# Altium schematic sheet Cell Monitoring.SchDoc
size A; SheetNumber: 8; SheetTotal: 8
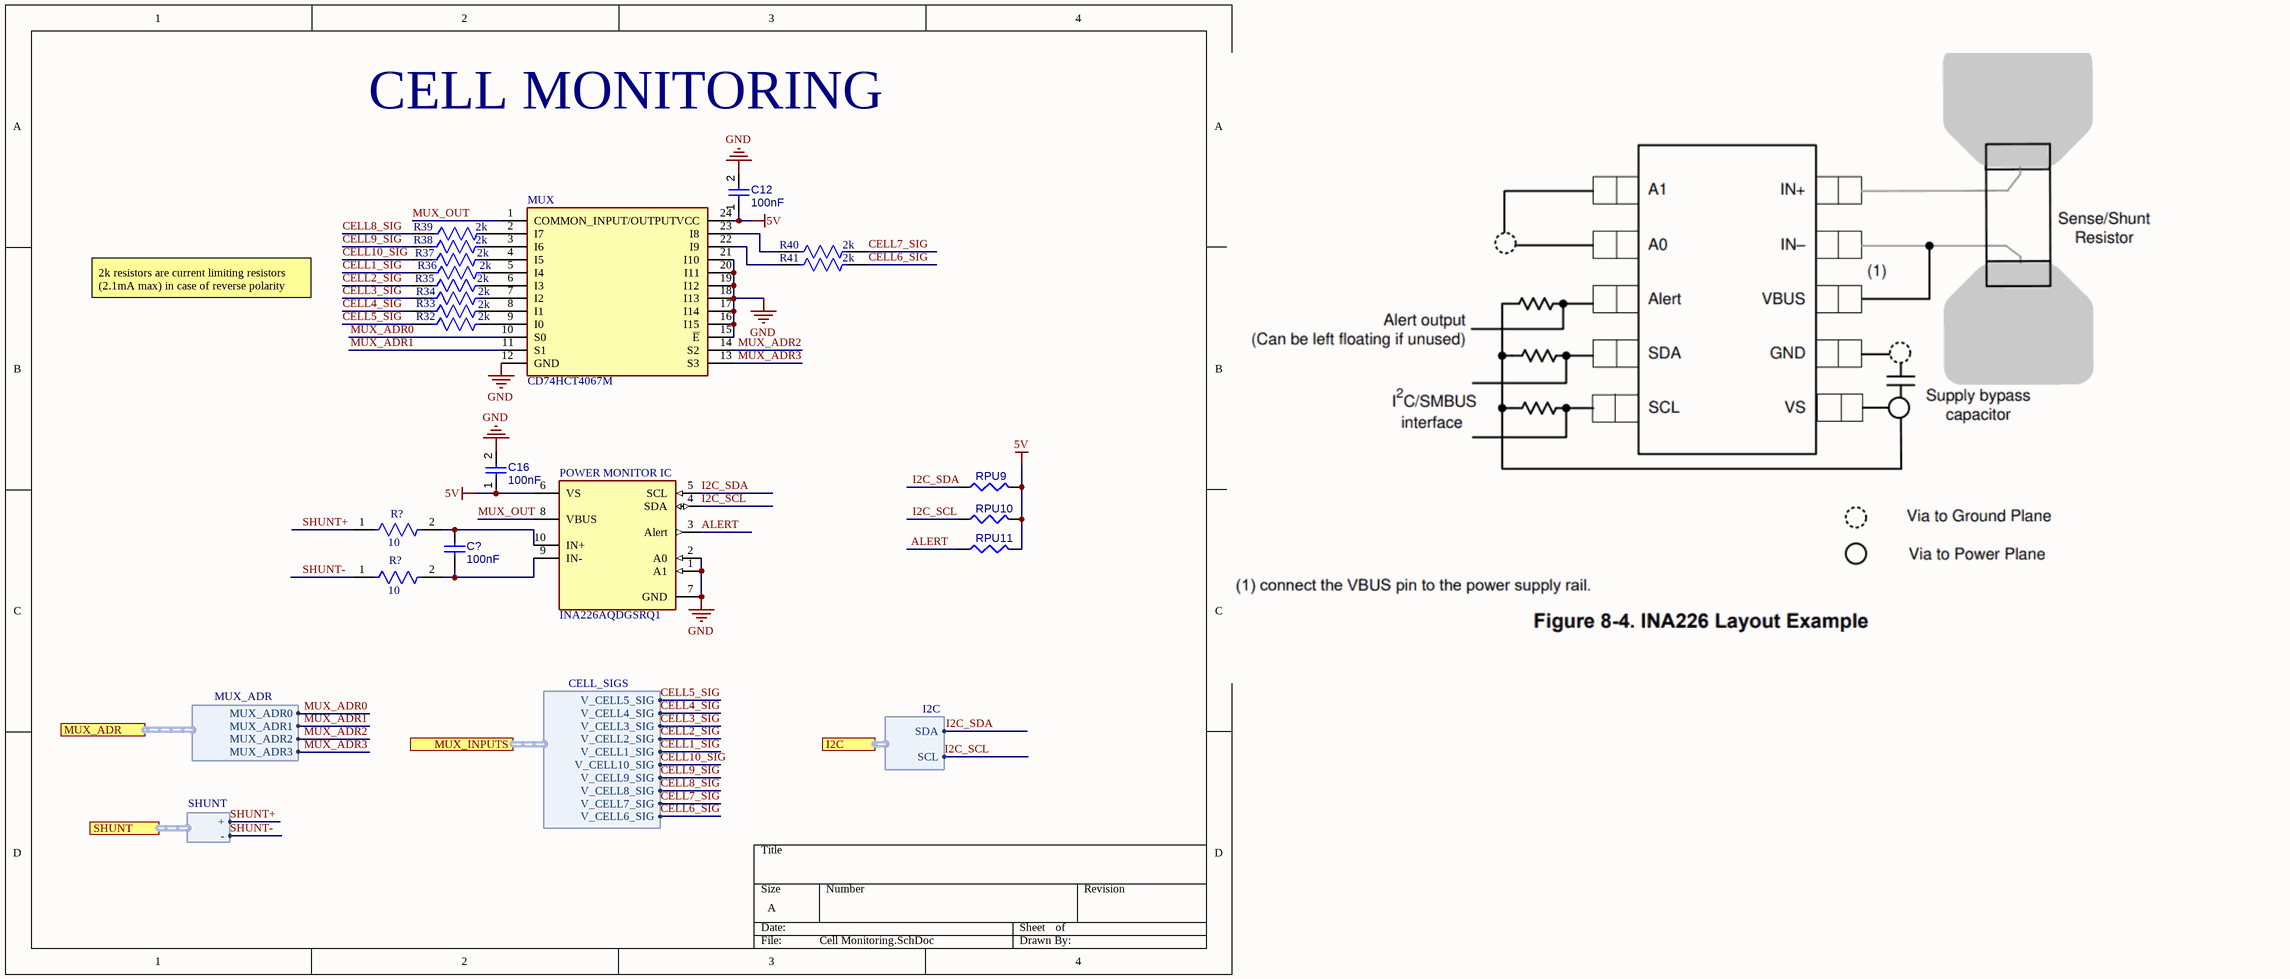
[diagram p0: Cell Monitoring.SchDoc]

## Parts
(Parts that share a designator on the sheet are numbered #1, #2 ... from top to bottom, then left to right.)
C12  100nF  [CAPC2013X95X50LL10T25]
C16  100nF  [CAPC2013X95X50LL10T25]
C?  100nF  [CAPC2013X95X50LL10T25]
MUX  CD74HCT4067M  [SOIC127P1030X265-24N]
POWER_MONITOR_IC  INA226AQDGSRQ1  [FP-DGS0010A-IPC_A]
R32  2k  [FP-TFCR0603-IPC_B]
R33  2k  [FP-TFCR0603-IPC_B]
R34  2k  [FP-TFCR0603-IPC_B]
R35  2k  [FP-TFCR0603-IPC_B]
R36  2k  [FP-TFCR0603-IPC_B]
R37  2k  [FP-TFCR0603-IPC_B]
R38  2k  [FP-TFCR0603-IPC_B]
R39  2k  [FP-TFCR0603-IPC_B]
R40  2k  [FP-TFCR0603-IPC_B]
R41  2k  [FP-TFCR0603-IPC_B]
R?#1  10  [FP-CR0805-IPC_B]
R?#2  10  [FP-CR0805-IPC_B]
RPU9  Resistor 4k7 +/-1% 0805 125 mW  [RESC2013X70X40ML20T20]  (value not drawn)
RPU10  Resistor 4k7 +/-1% 0805 125 mW  [RESC2013X70X40ML20T20]  (value not drawn)
RPU11  Resistor 4k7 +/-1% 0805 125 mW  [RESC2013X70X40ML20T20]  (value not drawn)

## Ports
I2C (harness I2C), MUX_ADR (harness MUX_ADR), MUX_INPUTS (harness CELL_SIGS), SHUNT (harness SHUNT)

## Harnesses
CELL_SIGS: V_CELL1_SIG, V_CELL2_SIG, V_CELL3_SIG, V_CELL4_SIG, V_CELL5_SIG, V_CELL6_SIG, V_CELL7_SIG, V_CELL8_SIG, V_CELL9_SIG, V_CELL10_SIG
MUX_ADR: MUX_ADR0, MUX_ADR1, MUX_ADR2, MUX_ADR3
I2C: SDA, SCL
SHUNT: +, -

## Nets
5V: C12.1 C16.1 MUX.24(VCC) POWER_MONITOR_IC.6(VS) RPU9.2 RPU10.2 RPU11.2
GND: C12.2 C16.2 MUX.12(GND) MUX.15(~{E}) MUX.16(I15) MUX.17(I14) MUX.18(I13) MUX.19(I12) MUX.20(I11) MUX.21(I10) POWER_MONITOR_IC.1(A1) POWER_MONITOR_IC.2(A0) POWER_MONITOR_IC.7(GND)
ALERT: POWER_MONITOR_IC.3(Alert) RPU11.1
CELL1_SIG: R36.1 ; port MUX_INPUTS.V_CELL1_SIG
CELL2_SIG: R35.1 ; port MUX_INPUTS.V_CELL2_SIG
CELL3_SIG: R34.1 ; port MUX_INPUTS.V_CELL3_SIG
CELL4_SIG: R33.1 ; port MUX_INPUTS.V_CELL4_SIG
CELL5_SIG: R32.1 ; port MUX_INPUTS.V_CELL5_SIG
CELL6_SIG: R41.2 ; port MUX_INPUTS.V_CELL6_SIG
CELL7_SIG: R40.2 ; port MUX_INPUTS.V_CELL7_SIG
CELL8_SIG: R39.1 ; port MUX_INPUTS.V_CELL8_SIG
CELL9_SIG: R38.1 ; port MUX_INPUTS.V_CELL9_SIG
CELL10_SIG: R37.1 ; port MUX_INPUTS.V_CELL10_SIG
I2C_SCL: POWER_MONITOR_IC.4(SDA) RPU10.1 ; port I2C.SCL
I2C_SDA: POWER_MONITOR_IC.5(SCL) RPU9.1 ; port I2C.SDA
MUX_ADR0: MUX.10(S0) ; port MUX_ADR.MUX_ADR0
MUX_ADR1: MUX.11(S1) ; port MUX_ADR.MUX_ADR1
MUX_ADR2: MUX.14(S2) ; port MUX_ADR.MUX_ADR2
MUX_ADR3: MUX.13(S3) ; port MUX_ADR.MUX_ADR3
MUX_OUT: MUX.1(COMMON_INPUT/OUTPUT) POWER_MONITOR_IC.8(VBUS)
SHUNT+: R?#1.1 ; port SHUNT.+
SHUNT-: R?#2.1 ; port SHUNT.-
NetC?_1: C?.1 POWER_MONITOR_IC.9(IN-) R?#2.2
NetC?_2: C?.2 POWER_MONITOR_IC.10(IN+) R?#1.2
NetMUX_3: MUX.3(I6) R38.2
NetMUX_4: MUX.4(I5) R37.2
NetMUX_6: MUX.6(I3) R35.2
NetMUX_7: MUX.7(I2) R34.2
NetMUX_8: MUX.8(I1) R33.2
NetMUX_9: MUX.9(I0) R32.2
NetMUX_22: MUX.22(I9) R41.1
NetMUX_23: MUX.23(I8) R40.1

Not connected (* = marked no-connect by the designer): MUX 2(I7) 5(I4); R36 2; R39 2

## Notes on the sheet
- CELL MONITORING
- 2k resistors are current limiting resistors (2.1mA max) in case of reverse polarity

## Library data of the parts
C12 C16 C? = CMP-001-00018-6: Capacitor 100 nF +/-10% 50 V 0805; Voltage Rating: 50V; Tolerance: 10%; Capacitor Type: Ceramic; Value: 100nF; Pins: 2; Max Operating Temperature: 125°C; Min Operating Temperature: -55°C; Mounting Technology: SM; Case/Package: 0805; RoHS Compliant: True
MUX = CD74HCT4067M: Integrated Circuit; Manufacturer_Name: Texas Instruments; Datasheet Link: http://www.ti.com/lit/gpn/cd74hct4067; Height: 2.65mm; Manufacturer_Part_Number: CD74HCT4067M; Mouser Part Number: 595-CD74HCT4067M; Mouser Price/Stock: https://www.mouser.co.uk/ProductDetail/Texas-Instruments/CD74HCT4067M?qs=vul0MlC%2Fa1fex%2F7NLRWpgQ%3D%3D; Arrow Part Number: CD74HCT4067M; Arrow Price/Stock: https://www.arrow.com/en/products/cd74hct4067m/texas-instruments?utm_currency=USD&region=nac
POWER_MONITOR_IC = CMP-04895-000197-1: IC MONITOR PWR/CURR BIDIR 10MSOP; Max Supply Voltage: 5.5V; Output Current: 10mA; Min Supply Voltage: 2.7V; Accuracy: 0.02%; Min Operating Temperature: -40°C; RoHS Compliant: Yes; Lead Free: Lead Free; Case/Package: VSSOP; Max Operating Temperature: 125°C; Mount: Surface Mount; Number of Pins: 10; Packaging: Tape and Reel
R32-R41 = CMP-250906-173560-1: TFCR0603-10W-E-2001BT
R?#1 R?#2 = CMP-07231-004657-1: Thick Film Chip Resistors 0805 10Ω 0.125W 1% 100ppm/°C; Voltage Rating (DC): 150V; Resistance: 10R; Power Rating: 125mW; Tolerance: 1%; Min Operating Temperature: -55°C; Length: 2mm; Case Code (Metric): 2012; Temperature Coefficient: 100ppm/°C; Height: 0.5mm; Max Operating Temperature: 155°C; Case/Package: 0805; Width: 1.25mm; Composition: Thick Film; Contact Plating: Tin; Termination: SMD/SMT; Packaging: Tape and Reel; REACH SVHC: No SVHC; Number of Pins: 2; Package Quantity: 5000; Mount: Surface Mount; Military Standard: Not; Thickness: 508um; Case Code (Imperial): 0805; Depth: 1.25mm; Radiation Hardening: No; Voltage Rating: 150V
RPU9-RPU11 = CMP-009-00032-5: Chip Resistor, 4.7 KOhm, +/- 1%, 0.125 W, -55 to 155 degC, 0805 (2012 Metric); Value: 4.7k; Voltage Rating: 150V; Power: 125mW; Tolerance: 1%; Mounting Technology: SM; RoHS Compliant: True; Min Operating Temperature: -55°C; Max Operating Temperature: 155°C; Case/Package: 0805; Pins: 2